# EAGLE design Milton (EAGLE 6.5.0)

## Sheet 1 of 2
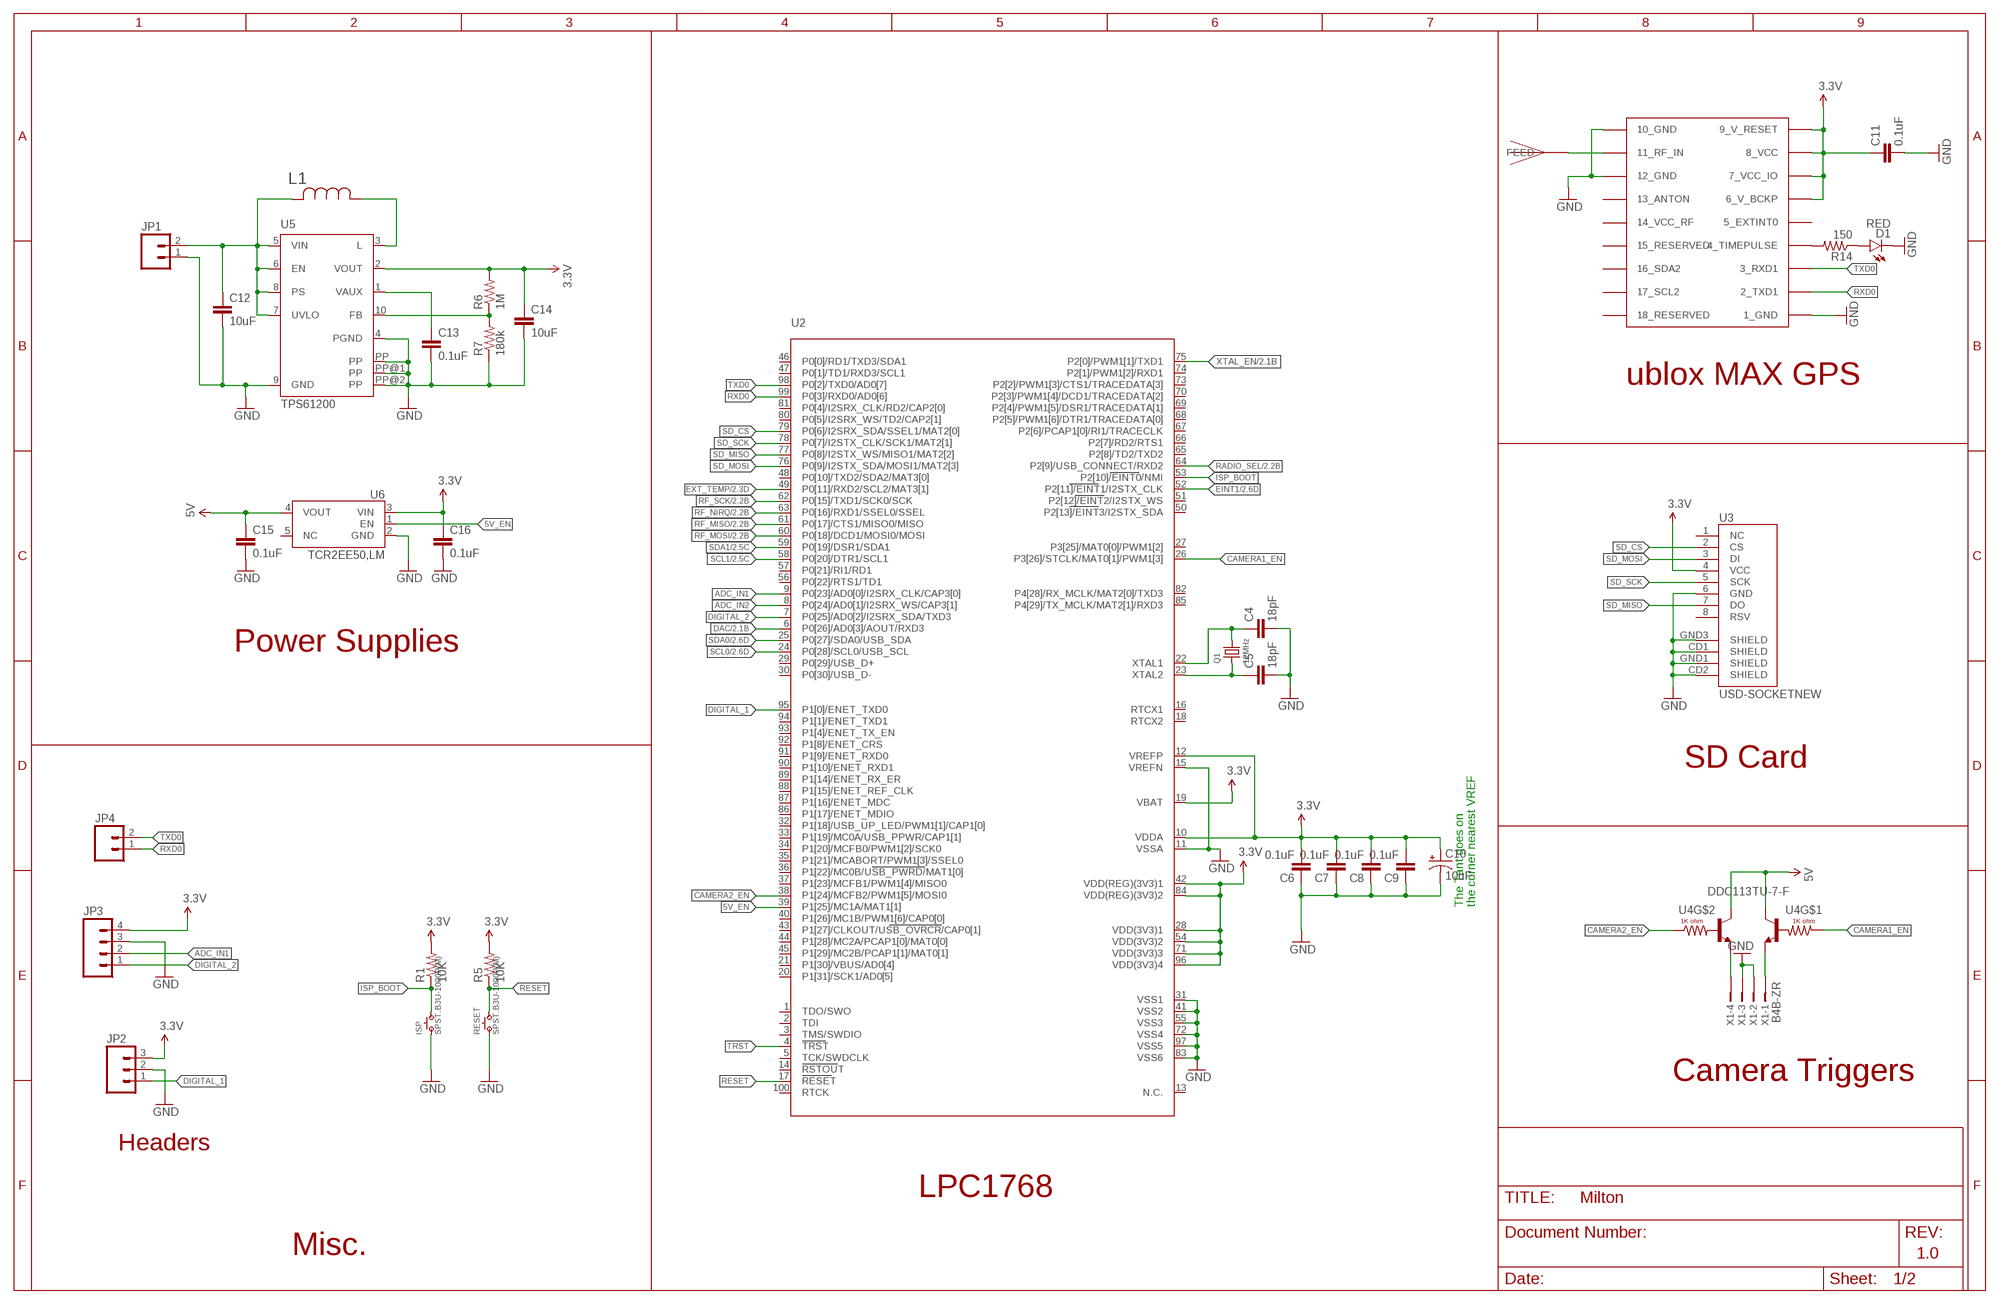
[diagram p0: schematic, sheet 1]

### Parts
C4  18pF  CAP0805  [0805]
C5  18pF  CAP0805  [0805]
C6  0.1uF  CAP0603-CAP  [0603-CAP]
C7  0.1uF  CAP0603-CAP  [0603-CAP]
C8  0.1uF  CAP0603-CAP  [0603-CAP]
C9  0.1uF  CAP0603-CAP  [0603-CAP]
C10  10uF  10UF-TANT  [EIA3216]
C11  0.1uF  CAP0603-CAP  [0603-CAP]
C12  10uF  CAP0805  [0805]
C13  0.1uF  CAP0603-CAP  [0603-CAP]
C14  10uF  CAP0805  [0805]
C15  0.1uF  CAP0603-CAP  [0603-CAP]
C16  0.1uF  CAP0603-CAP  [0603-CAP]
D1  RED  LED-RED0603  [LED-0603]
ISP  SPST.B3U-1000P(M)  [B3U-1000P(M)]
JP1  M02JST-PTH-2  [JST-2-PTH]
JP2  M03PTH  [1X03]
JP3  M04PTH  [1X04]
JP4  M02LOCK  [1X02_LOCK]
L1  SRN3015-2R2M  [IND_BOURNS_SRN3015]
Q1  12MHz  CRYSTALTHIN  [CRYSTAL_3.2X2.5]
R1  10K  RESISTOR0603  [0603-RES]
R5  10K  RESISTOR0603  [0603-RES]
R6  1M  RESISTOR0603  [0603-RES]
R7  180k  RESISTOR0603  [0603-RES]
R14  150  RESISTOR0603  [0603-RES]
RESET  SPST.B3U-1000P(M)  [B3U-1000P(M)]
U2  LPC1768  [LQFP100]
U3  USD-SOCKETNEW  [MICRO-SD-SOCKET-PP]
U4  DDC113TU-7-F  [SC70−6]
U5  TPS61200  [S-PDSO-N10]
U6  TCR2EE50,LM  IC_TCR2EEESV  [SOT50P160X60-5N]
U$2  1575AT43A40  JTI_ANTENNA-1575AT43A40  [JTI_ANTENNA-1575AT43A40]
U$3  UBLOX_MAX  [UBLOX_MAX]
X1  B4B-ZR  [B4B-ZR]

### Nets
3.3V [3.3v]: C6.2 C7.2 C8.2 C9.2 C10.A(+) C11.1 C14.1 C16.1 JP2.3 JP3.4 R1.2 R5.2 R6.2 U2.10(VDDA) U2.12(VREFP) U2.19(VBAT) U2.28(VDD(3V3)1) U2.42(VDD(REG)(3V3)1) U2.54(VDD(3V3)2) U2.71(VDD(3V3)3) U2.84(VDD(REG)(3V3)2) U2.96(VDD(3V3)4) U3.4(VCC) U5.2(VOUT) U6.3(VIN) U$3.6_V_BCKP U$3.7_VCC_IO U$3.8_VCC U$3.9_V_RESET ; also sheet 2
5V: C15.1 U4.3(C) U4.6(C) U6.4(VOUT)
5V_EN: U2.39(P1[25]/MC1A/MAT1[1]) U6.1(EN)
ADC_IN1: JP3.2 U2.9(P0[23]/AD0[0]/I2SRX_CLK/CAP3[0])
ADC_IN2: U2.8(P0[24]/AD0[1]/I2SRX_WS/CAP3[1])
CAM1: U4.1(E) X1.1
CAM2: U4.4(E) X1.4
CAMERA1_EN: U2.26(P3[26]/STCLK/MAT0[1]/PWM1[3]) U4.2(B)
CAMERA2_EN: U2.38(P1[24]/MCFB2/PWM1[5]/MOSI0) U4.5(B)
DAC: U2.6(P0[26]/AD0[3]/AOUT/RXD3) ; also sheet 2
DIGITAL_1: JP2.1 U2.95(P1[0]/ENET_TXD0)
DIGITAL_2: JP3.1 U2.7(P0[25]/AD0[2]/I2SRX_SDA/TXD3)
EINT1: U2.52(P2[11]/EINT1/I2STX_CLK) ; also sheet 2
EXT_TEMP: U2.49(P0[11]/RXD2/SCL2/MAT3[1]) ; also sheet 2
GND [gnd]: C4.2 C5.2 C6.1 C7.1 C8.1 C9.1 C10.C(-) C11.2 C12.2 C13.2 C14.2 C15.2 C16.2 D1.C ISP.1 JP1.1 JP2.2 JP3.3 R7.1 RESET.1 U2.11(VSSA) U2.15(VREFN) U2.31(VSS1) U2.41(VSS2) U2.55(VSS3) U2.72(VSS4) U2.83(VSS6) U2.97(VSS5) U3.6(GND) U3.CD1(SHIELD) U3.CD2(SHIELD) U3.GND1(SHIELD) U3.GND3(SHIELD) U5.4(PGND) U5.9(GND) U5.PP U5.PP@1(PP) U5.PP@2(PP) U6.2(GND) U$3.1_GND U$3.10_GND U$3.12_GND X1.2 X1.3 ; also sheet 2
IC6_RTC1: C4.1 Q1.2 U2.22(XTAL1)
IC6_RTC2: C5.1 Q1.1 U2.23(XTAL2)
ISP_BOOT: ISP.2 R1.1 U2.53(P2[10]/EINT0/NMI)
N$1: R6.1 R7.2 U5.10(FB)
N$8: U$2.FEED U$3.11_RF_IN
N$16: D1.A R14.1
N$19: L1.1 U5.3(L)
N$22: R14.2 U$3.4_TIMEPULSE
RADIO_SEL: U2.64(P2[9]/USB_CONNECT/RXD2) ; also sheet 2
RESET: R5.1 RESET.2 U2.17(RESET)
RF_MISO: U2.61(P0[17]/CTS1/MISO0/MISO) ; also sheet 2
RF_MOSI: U2.60(P0[18]/DCD1/MOSI0/MOSI) ; also sheet 2
RF_NIRQ: U2.63(P0[16]/RXD1/SSEL0/SSEL) ; also sheet 2
RF_SCK: U2.62(P0[15]/TXD1/SCK0/SCK) ; also sheet 2
RXD0: JP4.1 U2.99(P0[3]/RXD0/AD0[6]) U$3.2_TXD1
SCL0: U2.24(P0[28]/SCL0/USB_SCL) ; also sheet 2
SCL1: U2.58(P0[20]/DTR1/SCL1) ; also sheet 2
SD_CS: U2.79(P0[6]/I2SRX_SDA/SSEL1/MAT2[0]) U3.2(CS)
SD_MISO: U2.77(P0[8]/I2STX_WS/MISO1/MAT2[2]) U3.7(DO)
SD_MOSI: U2.76(P0[9]/I2STX_SDA/MOSI1/MAT2[3]) U3.3(DI)
SD_SCK: U2.78(P0[7]/I2STX_CLK/SCK1/MAT2[1]) U3.5(SCK)
SDA0: U2.25(P0[27]/SDA0/USB_SDA) ; also sheet 2
SDA1: U2.59(P0[19]/DSR1/SDA1) ; also sheet 2
TRST: U2.4(TRST)
TXD0: JP4.2 U2.98(P0[2]/TXD0/AD0[7]) U$3.3_RXD1
VAUX: C13.1 U5.1(VAUX)
VIN [VIN]: C12.1 JP1.2 L1.2 U5.5(VIN) U5.6(EN) U5.7(UVLO) U5.8(PS)
XTAL_EN: U2.75(P2[0]/PWM1[1]/TXD1) ; also sheet 2
Unconnected: U2.1(TDO/SWO) U2.2(TDI) U2.3(TMS/SWDIO) U2.5(TCK/SWDCLK) U2.13(N.C.) U2.14(RSTOUT) U2.16(RTCX1) U2.18(RTCX2) U2.20(P1[31]/SCK1/AD0[5]) U2.21(P1[30]/VBUS/AD0[4]) U2.27(P3[25]/MAT0[0]/PWM1[2]) U2.29(P0[29]/USB_D+) U2.30(P0[30]/USB_D-) U2.32(P1[18]/USB_UP_LED/PWM1[1]/CAP1[0]) U2.33(P1[19]/MC0A/USB_PPWR/CAP1[1]) U2.34(P1[20]/MCFB0/PWM1[2]/SCK0) U2.35(P1[21]/MCABORT/PWM1[3]/SSEL0) U2.36(P1[22]/MC0B/USB_PWRD/MAT1[0]) U2.37(P1[23]/MCFB1/PWM1[4]/MISO0) U2.40(P1[26]/MC1B/PWM1[6]/CAP0[0]) U2.43(P1[27]/CLKOUT/USB_OVRCR/CAP0[1]) U2.44(P1[28]/MC2A/PCAP1[0]/MAT0[0]) U2.45(P1[29]/MC2B/PCAP1[1]/MAT0[1]) U2.46(P0[0]/RD1/TXD3/SDA1) U2.47(P0[1]/TD1/RXD3/SCL1) U2.48(P0[10]/TXD2/SDA2/MAT3[0]) U2.50(P2[13]/EINT3/I2STX_SDA) U2.51(P2[12]/EINT2/I2STX_WS) U2.56(P0[22]/RTS1/TD1) U2.57(P0[21]/RI1/RD1) U2.65(P2[8]/TD2/TXD2) U2.66(P2[7]/RD2/RTS1) U2.67(P2[6]/PCAP1[0]/RI1/TRACECLK) U2.68(P2[5]/PWM1[6]/DTR1/TRACEDATA[0]) U2.69(P2[4]/PWM1[5]/DSR1/TRACEDATA[1]) U2.70(P2[3]/PWM1[4]/DCD1/TRACEDATA[2]) U2.73(P2[2]/PWM1[3]/CTS1/TRACEDATA[3]) U2.74(P2[1]/PWM1[2]/RXD1) U2.80(P0[5]/I2SRX_WS/TD2/CAP2[1]) U2.81(P0[4]/I2SRX_CLK/RD2/CAP2[0]) U2.82(P4[28]/RX_MCLK/MAT2[0]/TXD3) U2.85(P4[29]/TX_MCLK/MAT2[1]/RXD3) U2.86(P1[17]/ENET_MDIO) U2.87(P1[16]/ENET_MDC) U2.88(P1[15]/ENET_REF_CLK) U2.89(P1[14]/ENET_RX_ER) U2.90(P1[10]/ENET_RXD1) U2.91(P1[9]/ENET_RXD0) U2.92(P1[8]/ENET_CRS) U2.93(P1[4]/ENET_TX_EN) U2.94(P1[1]/ENET_TXD1) U2.100(RTCK) U3.1(NC) U3.8(RSV) U6.5(NC) U$3.5_EXTINT0 U$3.13_ANTON U$3.14_VCC_RF U$3.15_RESERVED U$3.16_SDA2 U$3.17_SCL2 U$3.18_RESERVED

### Notes on the sheet
- ublox MAX GPS
- Power Supplies
- SD Card
- The Tant goes on 
  the corner nearest VREF
- Camera Triggers
- Headers
- LPC1768
- Misc. | 1.0

## Sheet 2 of 2
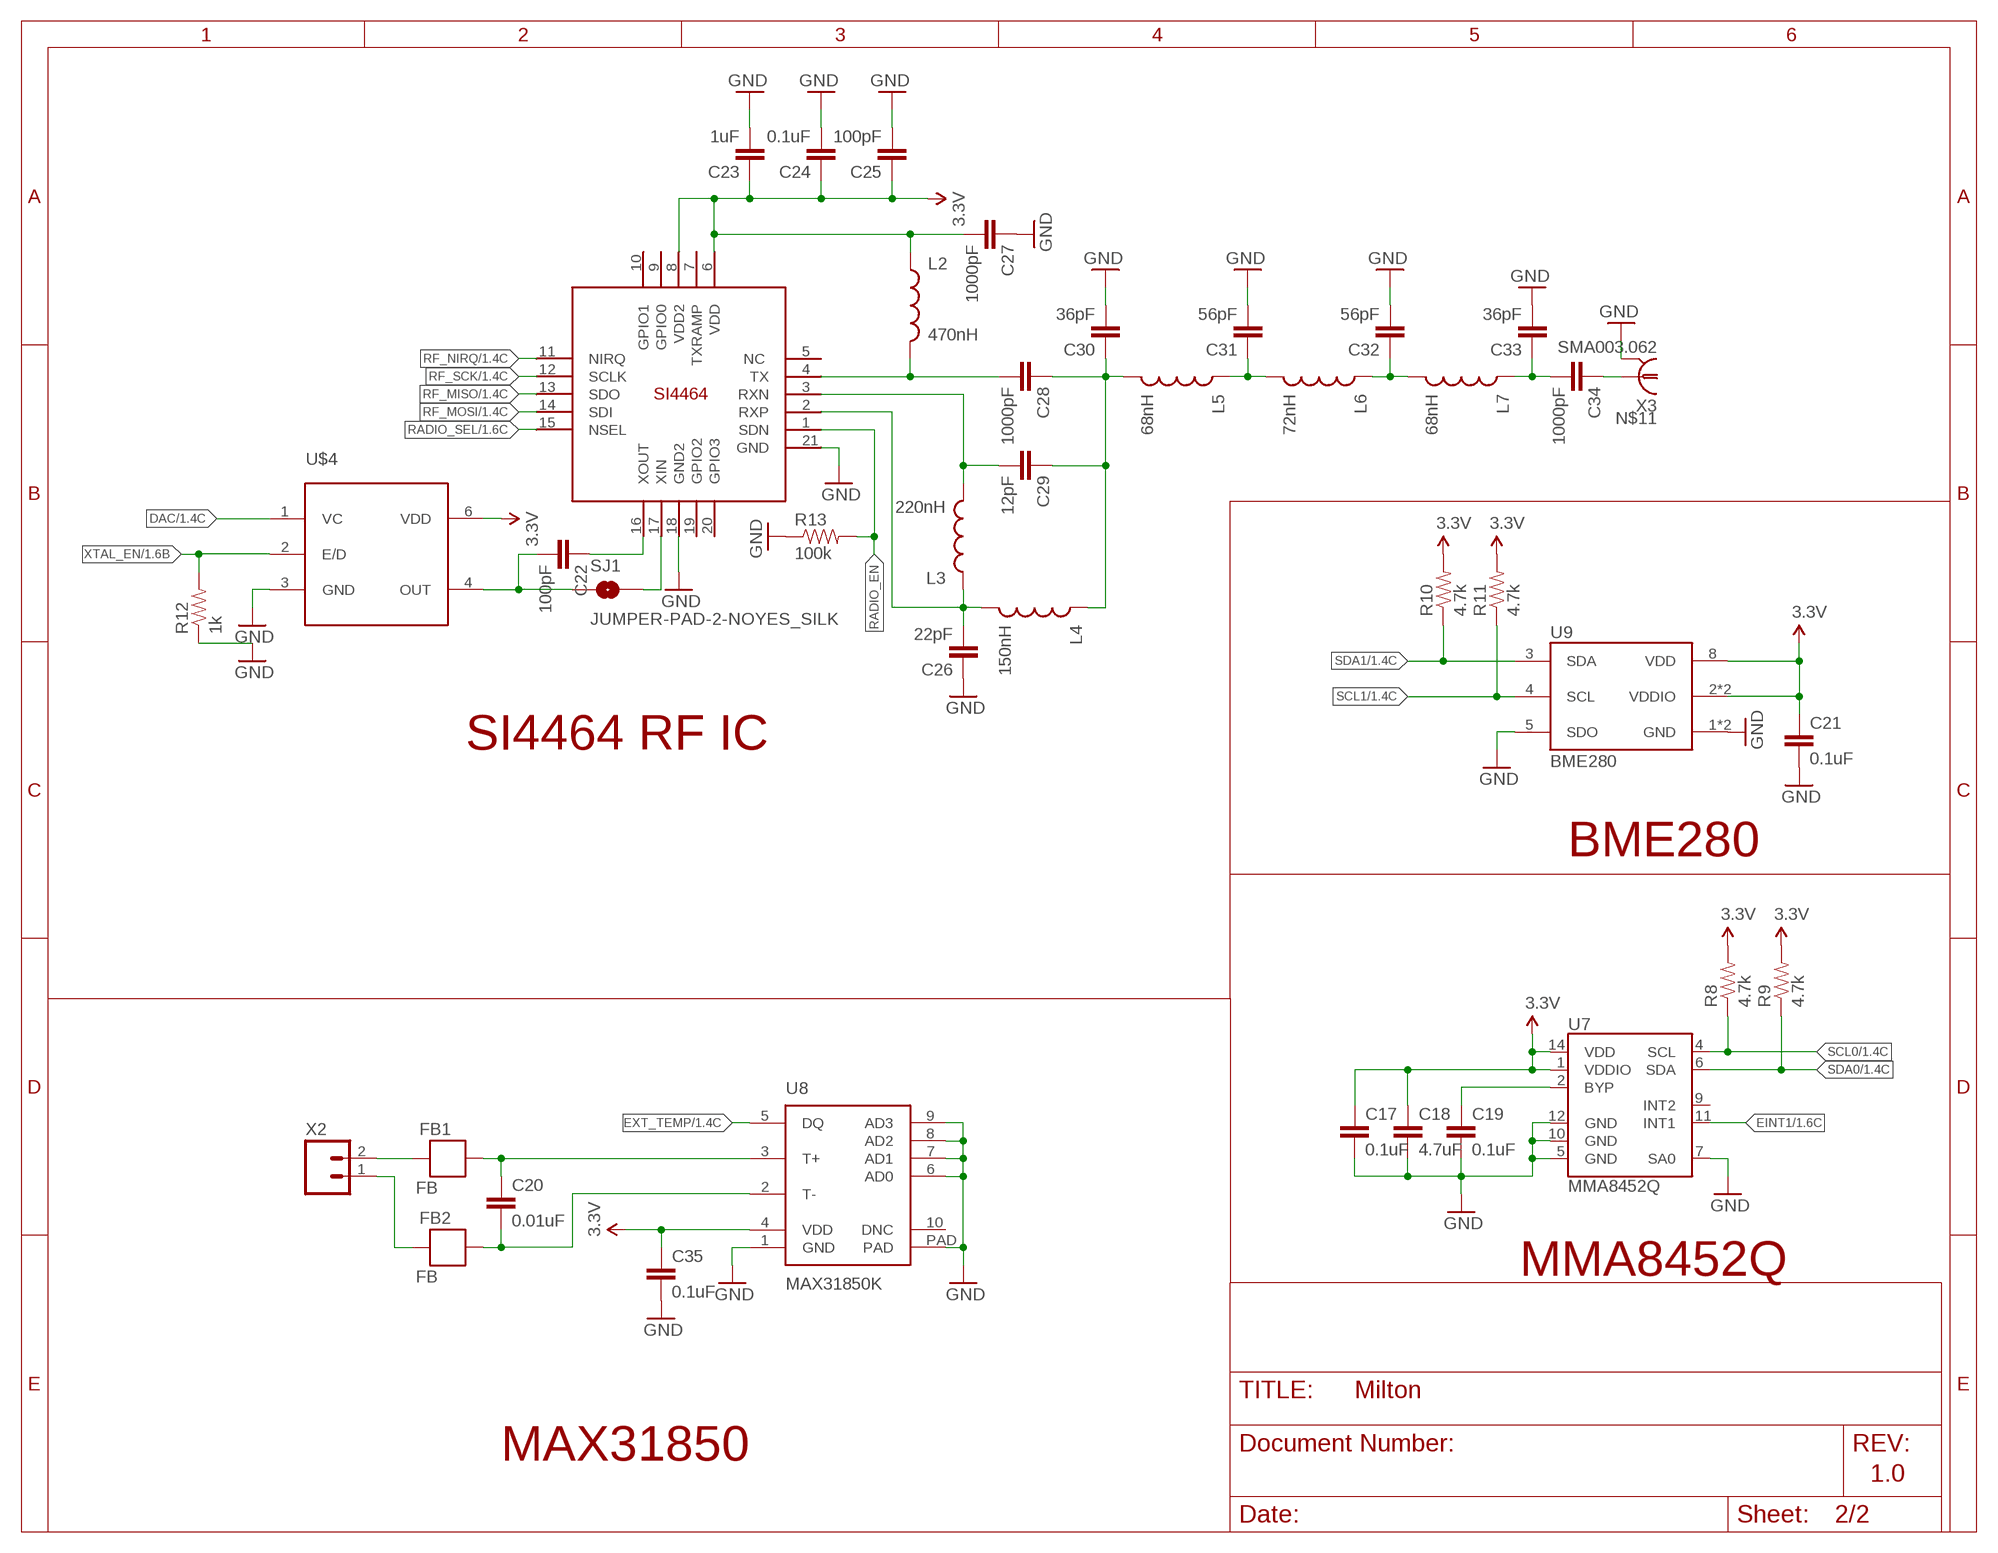
[diagram p1: schematic, sheet 2]

### Parts
C17  0.1uF  CAP0805  [0805]
C18  4.7uF  CAP0603-CAP  [0603-CAP]
C19  0.1uF  CAP0805  [0805]
C20  0.01uF  CAP0805  [0805]
C21  0.1uF  CAP0805  [0805]
C22  100pF  CAP0603-CAP  [0603-CAP]
C23  1uF  CAP0603-CAP  [0603-CAP]
C24  0.1uF  CAP0603-CAP  [0603-CAP]
C25  100pF  CAP0603-CAP  [0603-CAP]
C26  22pF  CAP0805  [0805]
C27  1000pF  CAP0603-CAP  [0603-CAP]
C28  1000pF  CAP0603-CAP  [0603-CAP]
C29  12pF  CAP0603-CAP  [0603-CAP]
C30  36pF  CAP0603-CAP  [0603-CAP]
C31  56pF  CAP0603-CAP  [0603-CAP]
C32  56pF  CAP0603-CAP  [0603-CAP]
C33  36pF  CAP0603-CAP  [0603-CAP]
C34  1000pF  CAP0805  [0805]
C35  0.1uF  CAP0805  [0805]
FB1  FB  [0603]
FB2  FB  [0603]
L2  470nH  INDUCTOR0603  [0603]
L3  220nH  INDUCTOR0603  [0603]
L4  150nH  INDUCTOR0603  [0603]
L5  68nH  INDUCTOR0603  [0603]
L6  72nH  INDUCTOR0603  [0603]
L7  68nH  INDUCTOR0603  [0603]
R8  4.7k  RESISTOR0603  [0603-RES]
R9  4.7k  RESISTOR0603  [0603-RES]
R10  4.7k  RESISTOR0603  [0603-RES]
R11  4.7k  RESISTOR0603  [0603-RES]
R12  1k  RESISTOR0603  [0603-RES]
R13  100k  RESISTOR0603  [0603-RES]
SJ1  JUMPER-PAD-2-NOYES_SILK  [PAD-JUMPER-2-NO_YES_SILK]
U7  MMA8452Q  [QFN-16_0.5MM]
U8  MAX31850K  [10-TDFN-EP]
U9  BME280  [BME280]
U10  SI4464  [QFN20+GNDPAD]
U$4  FVXO-HC53BR-27  [6-SMD]
X2  M023.5MM  [SCREWTERMINAL-3.5MM-2]
X3  SMA003.062  [SMA003.062]

### Nets
3.3V [3.3v]: C17.1 C18.1 C21.1 C23.1 C24.1 C25.1 C27.2 C35.1 L2.1 R8.2 R9.2 R10.2 R11.2 U7.1(VDDIO) U7.14(VDD) U8.4(VDD) U9.2(VDDIO) U9.6(VDDIO) U9.8(VDD) U10.6(VDD) U10.8(VDD2) U$4.6(VDD) ; also sheet 1
DAC: U$4.1(VC) ; also sheet 1
EINT1: U7.11(INT1) ; also sheet 1
EXT_TEMP: U8.5(DQ) ; also sheet 1
GND [gnd]: C17.2 C18.2 C19.2 C21.2 C23.2 C24.2 C25.2 C26.1 C27.1 C30.2 C31.2 C32.2 C33.2 C35.2 R12.1 R13.1 U7.5(GND) U7.7(SA0) U7.10(GND) U7.12(GND) U8.1(GND) U8.6(AD0) U8.7(AD1) U8.8(AD2) U8.9(AD3) U8.PAD U9.1(GND) U9.5(SDO) U9.7(GND) U10.18(GND2) U10.21(GND) U$4.3(GND) X3.C2 X3.C3 X3.C4 X3.C5 ; also sheet 1
N$2: C19.1 U7.2(BYP)
N$6: C22.1 U10.16(XOUT)
N$11: C32.1 L6.1 L7.2
N$18: C28.2 L2.2 U10.4(TX)
N$20: C29.2 L3.2 U10.3(RXN)
N$28: C22.2 SJ1.1 U$4.4(OUT)
N$29: C26.2 L3.1 L4.2 U10.2(RXP)
N$30: C33.1 C34.2 L7.1
N$33: C34.1 X3.RF
N$36: C28.1 C29.1 C30.1 L4.1 L5.2
N$37: C31.1 L5.1 L6.2
N$38: SJ1.2 U10.17(XIN)
RADIO_EN: R13.2 U10.1(SDN)
RADIO_SEL: U10.15(NSEL) ; also sheet 1
RF_MISO: U10.13(SDO) ; also sheet 1
RF_MOSI: U10.14(SDI) ; also sheet 1
RF_NIRQ: U10.11(NIRQ) ; also sheet 1
RF_SCK: U10.12(SCLK) ; also sheet 1
SCL0: R8.1 U7.4(SCL) ; also sheet 1
SCL1: R11.1 U9.4(SCL) ; also sheet 1
SDA0: R9.1 U7.6(SDA) ; also sheet 1
SDA1: R10.1 U9.3(SDA) ; also sheet 1
TM_FILT: C20.2 FB2.1 U8.2(T-)
TM_RAW: FB2.2 X2.1
TP_FILT: C20.1 FB1.1 U8.3(T+)
TP_RAW: FB1.2 X2.2
XTAL_EN: R12.2 U$4.2(E/D) ; also sheet 1
Unconnected: U7.9(INT2) U8.10(DNC) U10.5(NC ) U10.7(TXRAMP) U10.9(GPIO0) U10.10(GPIO1) U10.19(GPIO2) U10.20(GPIO3)

### Notes on the sheet
- SI4464 RF IC
- BME280
- MMA8452Q
- MAX31850
- 1.0

## Library data of the parts
C4 C5 = SparkFun-Capacitors:CAP: Capacitor Standard 0603 ceramic capacitor, and 0.1" leaded capacitor.; MPN: C0603C180K3GACTU
C6-C9 C13 C15-C17 C19 C21 C24 C35 = SparkFun-Capacitors:CAP: Capacitor Standard 0603 ceramic capacitor, and 0.1" leaded capacitor.; MPN: CL10B104KO8NNNC
C10 = SparkFun-Capacitors:10UF-TANT: 10uF Tantalum SMT CAP-00811- 16V 10% (EIA-3216); MPN: F931A106KAA; PROD_ID: CAP-00811
C11 = SparkFun:CAP: Capacitor Standard 0603 ceramic capacitor, and 0.1" leaded capacitor.; MPN: CL10B104KO8NNNC
C12 C14 = SparkFun-Capacitors:CAP: Capacitor Standard 0603 ceramic capacitor, and 0.1" leaded capacitor.; MPN: GRM21BR61C106KE15L
C18 = SparkFun-Capacitors:CAP: Capacitor Standard 0603 ceramic capacitor, and 0.1" leaded capacitor.; MPN: CC0603KRX5R6BB475
C20 = SparkFun-Capacitors:CAP: Capacitor Standard 0603 ceramic capacitor, and 0.1" leaded capacitor.; MPN: C0603C103J5RACTU
C22 C25 = SparkFun-Capacitors:CAP: Capacitor Standard 0603 ceramic capacitor, and 0.1" leaded capacitor.; MPN: CL10B101KB8NNNC
C23 = SparkFun-Capacitors:CAP: Capacitor Standard 0603 ceramic capacitor, and 0.1" leaded capacitor.; MPN: CL10B105KP8NNNC
C26 = SparkFun:CAP: Capacitor Standard 0603 ceramic capacitor, and 0.1" leaded capacitor.; MPN: C1608C0G1H220J080AA
C27 C28 = SparkFun-Capacitors:CAP: Capacitor Standard 0603 ceramic capacitor, and 0.1" leaded capacitor.; MPN: C0603C102J5RACTU
C29 = SparkFun-Capacitors:CAP: Capacitor Standard 0603 ceramic capacitor, and 0.1" leaded capacitor.; MPN: CL10C120JB8NNNC
C30 C33 = SparkFun-Capacitors:CAP: Capacitor Standard 0603 ceramic capacitor, and 0.1" leaded capacitor.; MPN: GRM1885C1H360JA01D
C31 C32 = SparkFun-Capacitors:CAP: Capacitor Standard 0603 ceramic capacitor, and 0.1" leaded capacitor.; MPN: CL10C560JB8NNNC
C34 = SparkFun:CAP: Capacitor Standard 0603 ceramic capacitor, and 0.1" leaded capacitor.; MPN: C0603C102J5RACTU
D1 = SparkFun-LED:LED-RED: Assorted Red LEDs LilyPad 1206- DIO-09912 1206- DIO-00809 0603- DIO-00819; MPN: LS L29K-G1J2-1-Z; PROD_ID: DIO-00819
FB1 FB2 = SparkFun-Passives:FB; MPN: BLM18PG471SN1D
ISP RESET = omron:SPST
JP1 = SparkFun-Connectors:M02: Standard 2-pin 0.1" header. Use with - straight break away headers ( PRT-00116) - right angle break away headers (PRT-00553) - swiss pins (PRT-00743) - machine pins (PRT-00117) - female headers (PRT-00115) Molex polarized connector foot print use with: PRT-08233 with associated crimp pins and housings. 2.54_SCREWTERM for use with PRT-10571. 3.5mm Screw Terminal footprints for PRT-08084 5mm Screw Terminal footprints for use with PRT-08432; MPN: S2B-PH-K-S(LF)(SN); PROD_ID: CONN-09863; SKU: PRT-09914
JP2 = SparkFun-Connectors:M03: Header 3 Standard 3-pin 0.1" header. Use with straight break away headers (SKU : PRT-00116), right angle break away headers (PRT-00553), swiss pins (PRT-00743), machine pins (PRT-00117), and female headers (PRT-00115). Molex polarized connector foot print use with SKU : PRT-08232 with associated crimp pins and housings.
JP3 = SparkFun-Connectors:M04: Header 4 Standard 4-pin 0.1" header. Use with straight break away headers (SKU : PRT-00116), right angle break away headers (PRT-00553), swiss pins (PRT-00743), machine pins (PRT-00117), and female headers (PRT-00115). Molex polarized connector foot print use with SKU : PRT-08231 with associated crimp pins and housings. 1MM SMD Version SKU: PRT-10208
JP4 = SparkFun-Connectors:M02: Standard 2-pin 0.1" header. Use with - straight break away headers ( PRT-00116) - right angle break away headers (PRT-00553) - swiss pins (PRT-00743) - machine pins (PRT-00117) - female headers (PRT-00115) Molex polarized connector foot print use with: PRT-08233 with associated crimp pins and housings. 2.54_SCREWTERM for use with PRT-10571. 3.5mm Screw Terminal footprints for PRT-08084 5mm Screw Terminal footprints for use with PRT-08432
L1 = wrea:SRN3015-2R2M; MANUFACTURER_PART_NUMBER: SRN3015-2R2M; MPN: SRN3015-4R7M; VENDOR: Bourns Electronics
L2 = SparkFun-Passives:INDUCTOR: Inductors Basic Inductor/Choke - 0603 and 1206. Footprints are not proven and vary greatly between part numbers. SRN6045- 33uH, 20% 1.4A SDR0403-560KL - 56uH, 10%, 500mA RMS/740mA peak; MPN: L0603CR47JRMST
L3 = SparkFun-Passives:INDUCTOR: Inductors Basic Inductor/Choke - 0603 and 1206. Footprints are not proven and vary greatly between part numbers. SRN6045- 33uH, 20% 1.4A SDR0403-560KL - 56uH, 10%, 500mA RMS/740mA peak; MPN: LQW18ANR22G00D
L4 = SparkFun-Passives:INDUCTOR: Inductors Basic Inductor/Choke - 0603 and 1206. Footprints are not proven and vary greatly between part numbers. SRN6045- 33uH, 20% 1.4A SDR0403-560KL - 56uH, 10%, 500mA RMS/740mA peak; MPN: LQW18ANR15G00D
L5 L7 = SparkFun-Passives:INDUCTOR: Inductors Basic Inductor/Choke - 0603 and 1206. Footprints are not proven and vary greatly between part numbers. SRN6045- 33uH, 20% 1.4A SDR0403-560KL - 56uH, 10%, 500mA RMS/740mA peak; MPN: LQW18AN68NG00D
L6 = SparkFun-Passives:INDUCTOR: Inductors Basic Inductor/Choke - 0603 and 1206. Footprints are not proven and vary greatly between part numbers. SRN6045- 33uH, 20% 1.4A SDR0403-560KL - 56uH, 10%, 500mA RMS/740mA peak; MPN: LQW18AN72NG00D
Q1 = microbuilder:CRYSTAL: Crystals HC49UP - Surface Mount Crystal 4.0MHz 18pF +/-30ppm Surface Mount Crystal [Digikey: 535-9857-1-ND] 12.0 MHz Surface Mount Crystal [Digikey: 535-9869-6-ND] 25.0 MHz Surface Mount Crystal [Digikey: 535-9078-1-ND] 3.2 x 2.5mm - MEMs SMT Crystal 12.0 MHz 8pF 15ppm 3.2 x 2.5mm Crystal [Digikey: -10-70°C: 644-1047-1-ND -40-125°C: 644-1128-1-ND] 16.0 MHz 8pF 15ppm 3.2 x 2.5mm Crystal [Digikey: -10-70°C: 644-1049-1-ND -40-125°C: 644-1129-2-ND] 16.0 MHz 10pF 10ppm 3.2 x 2.5mm Crystal [Digikey: 644-1100-1-ND] 27.12 MHz 18pF 30ppm 3.2 x 2.5mm Crystal [Digikey: 887-1424-1-ND] 27.12MHz 10pF 10ppm 3.2 x 2.5mm Crystal [Digikey: 887-1329-1-ND] 4.9 x 1.8mm - MEMs SMT Crystal 32.768 KHz 12.5pF 20ppm 4.9 x 1.8mm Crystal [Digikey: SE2415CT-ND] Cylinder 32.768KHz Cylinder Crystal; MPN: 7V-12.000MAHE-T
R1 R5 = SparkFun-Resistors:RESISTOR: Resistor Basic schematic elements and footprints for 0603, 1206, and PTH resistors.; MPN: ESR03EZPJ103
R6 = SparkFun-Resistors:RESISTOR: Resistor Basic schematic elements and footprints for 0603, 1206, and PTH resistors.; MPN: MCT06030C1004FP500
R7 = SparkFun-Resistors:RESISTOR: Resistor Basic schematic elements and footprints for 0603, 1206, and PTH resistors.; MPN: RC1608F184CS
R8-R11 = SparkFun-Resistors:RESISTOR: Resistor Basic schematic elements and footprints for 0603, 1206, and PTH resistors.; MPN: ERJ-3GEYJ472V
R12 = SparkFun-Resistors:RESISTOR: Resistor Basic schematic elements and footprints for 0603, 1206, and PTH resistors.; MPN: RMCF0603JT1K00
R13 = SparkFun-Resistors:RESISTOR: Resistor Basic schematic elements and footprints for 0603, 1206, and PTH resistors.; MPN: MCT06030C1003FP500
R14 = SparkFun-Resistors:RESISTOR: Resistor Basic schematic elements and footprints for 0603, 1206, and PTH resistors.; MPN: ESR03EZPJ151
SJ1 = SparkFun-Passives:JUMPER-PAD-2-NO
U2 = microbuilder:LPC1768: LPC1768 100 MHz 32-bit ARM Cortex-M3 based microcontroller featuring a high level of integration and low power consumption. 512 kB Flash, 64 kB SRAM, USB Device/Host/OTG, Ethernet, CAN, I2S, 10-bit DAC Digikey: 568-4796-ND; MPN: LPC1768FBD100,551
U3 = SparkFun:USD-SOCKET: microSD Socket Push-push type uSD socket. Schematic element and footprint production proven. Spark Fun Electronics SKU : PRT-00127. tDoc lines correctly indicate media card edge positions when inserting (unlocked, locked, depressed).; MPN: 101-00660-68-6
U4 = wrea:DDC113TU-7-F; MPN: DDC113TU-7-F
U5 = texas:TPS6120*: LOW INPUT VOLTAGE SYNCHRONOUS BOOST CONVERTER WITH 1.3-A SWITCHES Source: http://focus.ti.com/lit/ds/symlink/tps61200.pdf; MPN: TPS61200DRCR; OC_FARNELL: 1471238; OC_NEWARK: 37M0066
U6 = Xevelabs:IC_TCR2EE
U7 = SparkFun-Sensors:MMA8452Q: MMA8452Q 3-Axis, 12/8-bit Digital Accelerometer Supply Voltage: 1.6-3.6V Range: +/- 2g, 4g, 8g Interface: I2C, 12-bit and 8-bit ODR: 1.56 Hz - 800 Hz Package: QFN-16 http://cache.freescale.com/files/sensors/doc/data_sheet/MMA8452Q.pdf; MPN: MMA8452QT; PROD_ID: IC-10769
U8 = LoganSmith-Analog_IC:MAX3185?*: Cold-Junction Compensated, 1-Wire Thermocouple-to-Digital Converters Datasheet <http://datasheets.maximintegrated.com/en/ds/MAX31850-MAX31851.pdf>; DIGIKEY_OC: MAX31850KATB+-ND; MFR: Maxim Integrated; MPN: MAX31850TATB+; VALUE: Type K
U9 = wrea:BME280
U10 = ava:SI4464; MPN: SI4464-B1B-FM
U$2 = ava:JTI_ANTENNA-1575AT43A40; MPN: 1575AT43A0040E
U$3 = ava:UBLOX_MAX: UBLOX MAX; MPN: MAX-7C-0
U$4 = wrea:FVXO-HC53BR-27; MPN: FVXO-HC53BR-27
X1 = con-jst:?4B-ZR: ZH CONNECTOR 1.5 mm, 4 pin 1 row Source: http://www.jst.com .. eZH.pdf; MF: FARNELL; MPN: B4B-ZR(LF)(SN); OC_FARNELL: 1830916; OC_NEWARK: 37K9960
X2 = SparkFun-Connectors:M02: Standard 2-pin 0.1" header. Use with - straight break away headers ( PRT-00116) - right angle break away headers (PRT-00553) - swiss pins (PRT-00743) - machine pins (PRT-00117) - female headers (PRT-00115) Molex polarized connector foot print use with: PRT-08233 with associated crimp pins and housings. 2.54_SCREWTERM for use with PRT-10571. 3.5mm Screw Terminal footprints for PRT-08084 5mm Screw Terminal footprints for use with PRT-08432; MPN: ED555/2DS; PROD_ID: CONN-08399
X3 = wrea:SMA003.062

## Net classes
0 default: width 0.152 mm, drill 0.406 mm, clearance 0.152 mm
1 power: width 0.356 mm, drill 0.406 mm, clearance 0.152 mm
2 gnd: width 0.152 mm, drill 0.406 mm, clearance 0.203 mm
3 VIN: width 0.3 mm, drill 0.254 mm, clearance 0.152 mm
4 caps: width 3.54 mm, drill 0.406 mm, clearance 0.152 mm
5 3.3v: width 0.152 mm, drill 0.406 mm, clearance 0.152 mm

## Board
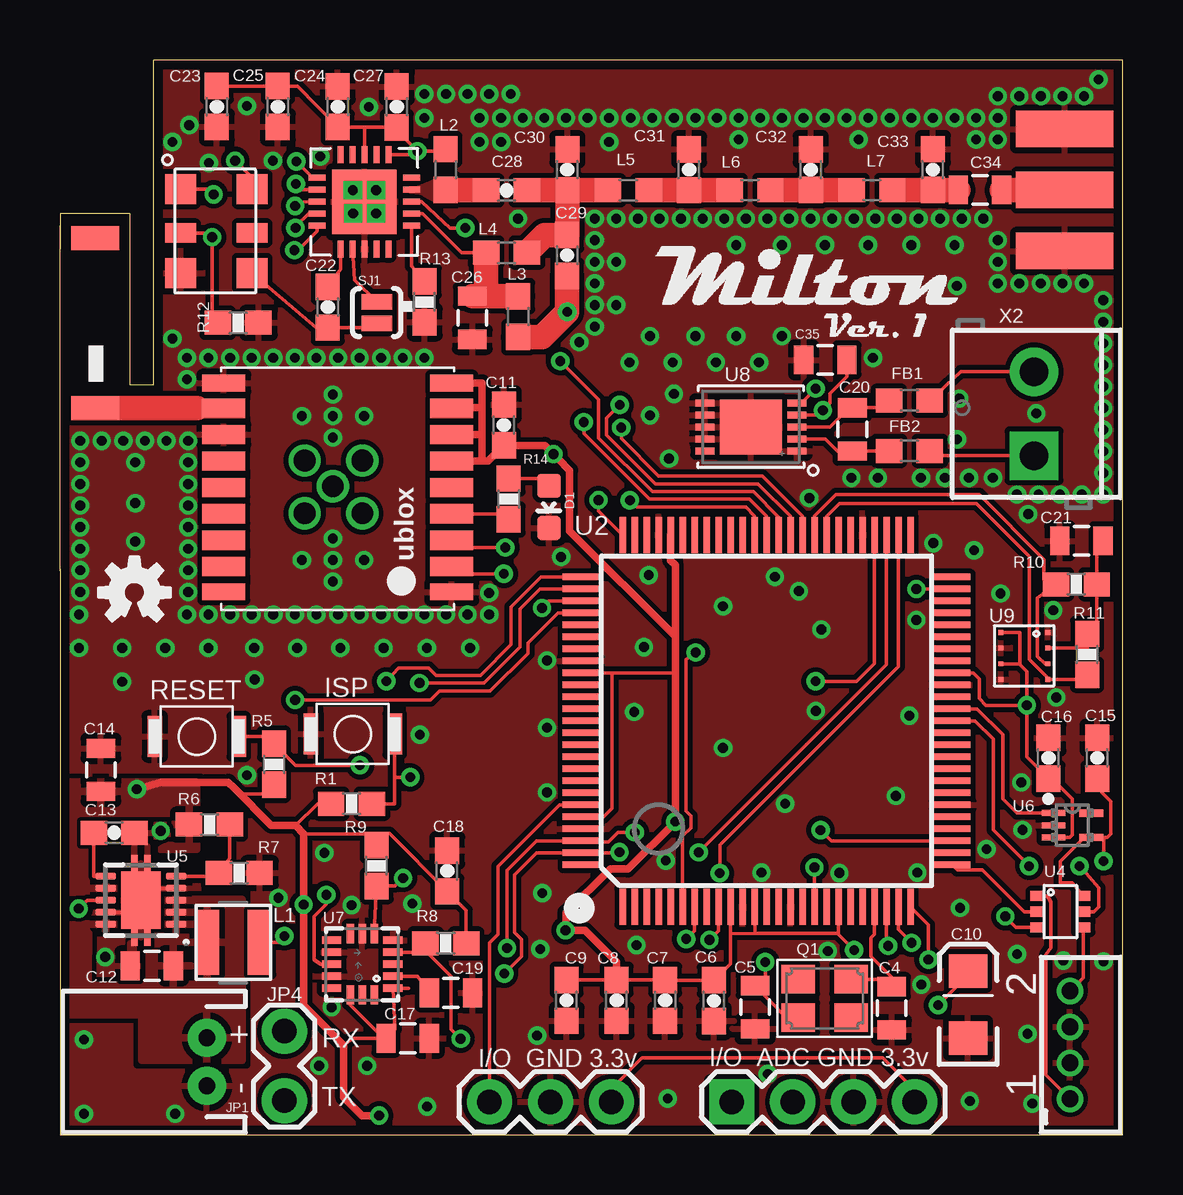
[diagram p2: board, top side]
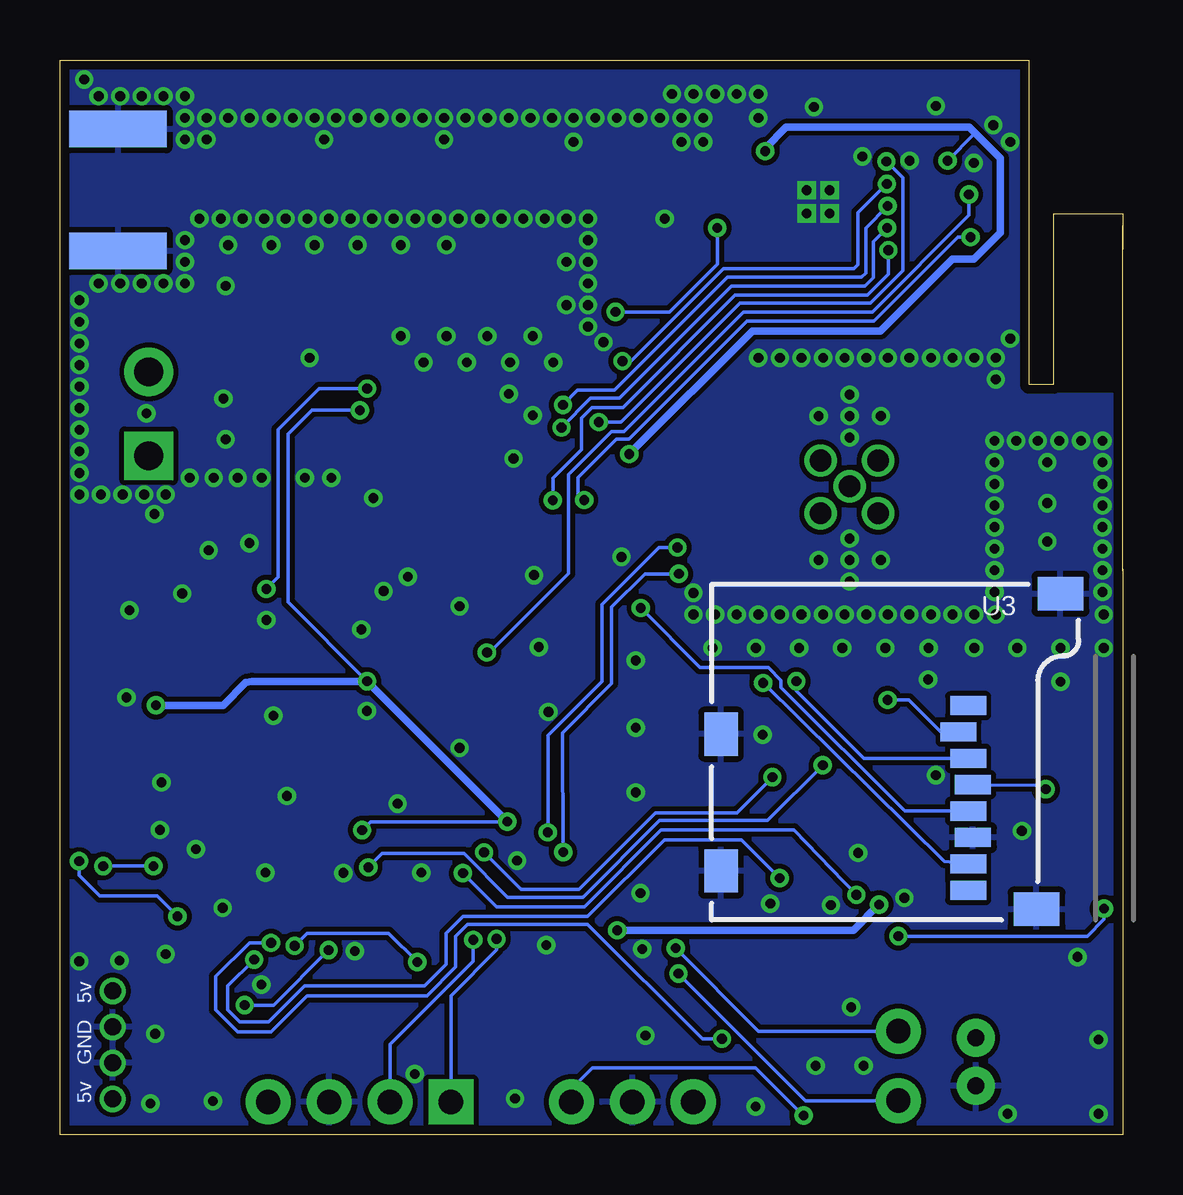
[diagram p3: board, bottom side, seen from below]

Size 44.3 x 44.8 mm. Coordinates in mm from the lower left corner, seen from the top.
Outline: 0,36.91 0,38.4 2.9,38.4 2.9,31.27 3.9,31.27 3.9,44.8 44.3,44.8 44.3,0 0,0 0,23.59
Outline: 0,23.5 0,37.9
Copper layers (1*16): Top 0.0356mm / dielectric 1.5011mm / Bottom 0.0356mm
Design rules "LaenPCBOrder": minimum track width 6mil, minimum drill 13mil, track to track 6mil, track to pad 6mil, pad to pad 6mil, via to via 6mil, smd to smd 6mil, copper to edge 15mil, drill to drill 6mil, minimum pad ring 7mil, minimum via ring 7mil, stop-mask expansion 3mil, vias tented up to drill 0mil, thermal gap 10mil

### Footprints (pad centres in the part's own frame; a part is rotated, then mirrored left to right if it is on the bottom)
0805 = smd 0.8 x 1.2: 1 -0.9,0; 2 0.9,0
0603-CAP = smd 1.1 x 1: 1 -0.85,0; 2 0.85,0
EIA3216 = smd 1.4 x 1.6: A 1.4,0; C -1.4,0
LED-0603 = smd 1 x 1: A 0,-0.877; C 0,0.877
0603 = smd 1.1 x 1: 1 -0.85,0; 2 0.85,0
B3U-1000P(M) = smd 0.6 x 1.7: 1 -1.75,0; 2 1.75,0
JST-2-PTH = drill 0.7 pad 1.6: 1 -1,0; 2 1,0
1X03 = drill 1.016 pad 1.88: 1 0,0; 2 2.54,0; 3 5.08,0
1X04 = drill 1.016 pad 1.88 square: 1 0,0 | drill 1.016 pad 1.88: 2 2.54,0; 3 5.08,0; 4 7.62,0
1X02_LOCK = drill 1.016 pad 1.88: 1 -0.178,0; 2 2.718,0
IND_BOURNS_SRN3015 = smd 0.991 x 2.692: 1 1.092,0; 2 -1.092,0
CRYSTAL_3.2X2.5 = smd 1.4 x 1.2: 1 -1.1,-0.8; 2 1.1,0.8; GND1 -1.1,0.8; GND2 1.1,-0.8
0603-RES = smd 1.1 x 1: 1 -0.85,0; 2 0.85,0
PAD-JUMPER-2-NO_YES_SILK = smd 0.635 x 1.27: 1 -0.45,0; 2 0.45,0
LQFP100 = smd 0.27 x 1.5: 1 -6,-7.75; 2 -5.5,-7.75; 3 -5,-7.75; 4 -4.5,-7.75; 5 -4,-7.75; 6 -3.5,-7.75; 7 -3,-7.75; 8 -2.5,-7.75; 9 -2,-7.75; 10 -1.5,-7.75; 11 -1,-7.75; 12 -0.5,-7.75; 13 0,-7.75; 14 0.5,-7.75; 15 1,-7.75; 16 1.5,-7.75; 17 2,-7.75; 18 2.5,-7.75; 19 3,-7.75; 20 3.5,-7.75; 21 4,-7.75; 22 4.5,-7.75; 23 5,-7.75; 24 5.5,-7.75; 25 6,-7.75; 51 6,7.75; 52 5.5,7.75; 53 5,7.75; 54 4.5,7.75; 55 4,7.75; 56 3.5,7.75; 57 3,7.75; 58 2.5,7.75; 59 2,7.75; 60 1.5,7.75; 61 1,7.75; 62 0.5,7.75; 63 0,7.75; 64 -0.5,7.75; 65 -1,7.75; 66 -1.5,7.75; 67 -2,7.75; 68 -2.5,7.75; 69 -3,7.75; 70 -3.5,7.75; 71 -4,7.75; 72 -4.5,7.75; 73 -5,7.75; 74 -5.5,7.75; 75 -6,7.75 | smd 1.5 x 0.27: 26 7.75,-6; 27 7.75,-5.5; 28 7.75,-5; 29 7.75,-4.5; 30 7.75,-4; 31 7.75,-3.5; 32 7.75,-3; 33 7.75,-2.5; 34 7.75,-2; 35 7.75,-1.5; 36 7.75,-1; 37 7.75,-0.5; 38 7.75,0; 39 7.75,0.5; 40 7.75,1; 41 7.75,1.5; 42 7.75,2; 43 7.75,2.5; 44 7.75,3; 45 7.75,3.5; 46 7.75,4; 47 7.75,4.5; 48 7.75,5; 49 7.75,5.5; 50 7.75,6; 76 -7.75,6; 77 -7.75,5.5; 78 -7.75,5; 79 -7.75,4.5; 80 -7.75,4; 81 -7.75,3.5; 82 -7.75,3; 83 -7.75,2.5; 84 -7.75,2; 85 -7.75,1.5; 86 -7.75,1; 87 -7.75,0.5; 88 -7.75,0; 89 -7.75,-0.5; 90 -7.75,-1; 91 -7.75,-1.5; 92 -7.75,-2; 93 -7.75,-2.5; 94 -7.75,-3; 95 -7.75,-3.5; 96 -7.75,-4; 97 -7.75,-4.5; 98 -7.75,-5; 99 -7.75,-5.5; 100 -7.75,-6
MICRO-SD-SOCKET-PP = smd 0.8 x 1.5: 1 -8.94,10.7; 2 -7.84,10.3; 3 -6.74,10.7; 4 -5.64,10.9; 5 -4.54,10.7; 6 -3.44,10.9; 7 -2.34,10.7; 8 -1.24,10.7 | smd 1.8 x 1.4: CD1 -2.05,0.4; CD2 -7.75,0.4 | smd 1.4 x 1.9: GND1 -13.6,14.55; GND3 -0.45,13.55
SC70−6 = smd 0.6 x 0.42: 1 -0.95,0.65; 2 -0.95,0; 3 -0.95,-0.65; 4 0.95,-0.65; 5 0.95,0; 6 0.95,0.65
S-PDSO-N10 = smd 0.28 x 0.85: 1 -1,-1.475; 2 -0.5,-1.475; 3 0,-1.475; 4 0.5,-1.475; 5 1,-1.475; 6 1,1.475; 7 0.5,1.475; 8 0,1.475; 9 -0.5,1.475; 10 -1,1.475 | smd 2.4 x 1.65: PP 0,0 | smd 3.8 x 0.28: PP@1 0,0.275; PP@2 0,-0.275
SOT50P160X60-5N = smd 0.991 x 0.254: 1 -0.787,0.508; 2 -0.787,0; 3 -0.787,-0.508 | smd 0.991 x 0.305: 4 0.787,-0.508; 5 0.787,0.508
QFN-16_0.5MM = smd 0.8 x 0.3: 1 -1.275,1; 2 -1.275,0.5; 3 -1.275,0; 4 -1.275,-0.5; 5 -1.275,-1; 9 1.275,-1; 10 1.275,-0.5; 11 1.275,0; 12 1.275,0.5; 13 1.275,1 | smd 0.3 x 0.8: 6 -0.5,-1.275; 7 0,-1.275; 8 0.5,-1.275; 14 0.5,1.275; 15 0,1.275; 16 -0.5,1.275
10-TDFN-EP = smd 0.79 x 0.3: 1 -1.92,1; 2 -1.92,0.5; 3 -1.92,0; 4 -1.92,-0.5; 5 -1.92,-1; 6 1.92,-1; 7 1.92,-0.5; 8 1.92,0; 9 1.92,0.5; 10 1.92,1 | smd 2.6 x 2.3: PAD 0,0
BME280 = smd 0.2 x 0.2: 1 -0.98,0.975; 2 -0.33,0.975; 3 0.33,0.975; 4 0.98,0.975; 5 0.98,-0.975; 6 0.33,-0.975; 7 -0.33,-0.975; 8 -0.98,-0.975
QFN20+GNDPAD = smd 0.7 x 0.25: 1 -1.97,1; 2 -1.97,0.5; 3 -1.97,0; 4 -1.97,-0.5; 5 -1.97,-1; 11 1.97,-1; 12 1.97,-0.5; 13 1.97,0; 14 1.97,0.5; 15 1.97,1 | smd 0.25 x 0.7: 6 -1,-1.97; 7 -0.5,-1.97; 8 0,-1.97; 9 0.5,-1.97; 10 1,-1.97; 16 1,1.97; 17 0.5,1.97; 18 0,1.97; 19 -0.5,1.97; 20 -1,1.97 | smd 2.7 x 2.7: 21 0,0
JTI_ANTENNA-1575AT43A40 = smd 1 x 2: FEED -3.175,0; NC 3.925,0
UBLOX_MAX = smd 1.8 x 0.7: 1_GND 4.95,-4.4; 9_V_RESET 4.95,4.3; 10_GND -4.55,4.3; 18_RESERVED -4.55,-4.4 | smd 1.8 x 0.8: 2_TXD1 4.95,-3.35; 3_RXD1 4.95,-2.25; 4_TIMEPULSE 4.95,-1.15; 5_EXTINT0 4.95,-0.05; 6_V_BCKP 4.95,1.05; 7_VCC_IO 4.95,2.15; 8_VCC 4.95,3.25; 11_RF_IN -4.55,3.25; 12_GND -4.55,2.15; 13_ANTON -4.55,1.05; 14_VCC_RF -4.55,-0.05; 15_RESERVED -4.55,-1.15; 16_SDA2 -4.55,-2.25; 17_SCL2 -4.55,-3.35
6-SMD = smd 1.24 x 1.29: 1 -1.745,-1.45; 3 1.745,-1.45; 4 1.745,1.535; 6 -1.745,1.535 | smd 0.8 x 1.29: 2 0.075,-1.45; 5 0.075,1.535
B4B-ZR = drill 0.7 pad 1.1: 1 -2.25,0; 2 -0.75,0; 3 0.75,0; 4 2.25,0
SCREWTERMINAL-3.5MM-2 = drill 1.2 pad 2.032 square: 1 0,0 | drill 1.2 pad 2.032: 2 3.5,0
SMA003.062 = smd 4.06 x 1.52: C2 -0.42,2.54; C3 -0.42,-2.54; RF -0.42,0 | smd 4.06 x 1.52 bottom: C4 -0.42,2.54; C5 -0.42,-2.54

### Placement (x,y rotation side)
C4  34.67,5.28 270 top
C5  28.98,5.32 270 top
C6  27.26,5.59 90 top
C7  25.23,5.6 90 top
C8  23.2,5.6 90 top
C9  21.11,5.6 90 top
C10  37.85,5.43 90 top
C11  18.5,29.58 90 top
C12  3.83,7.04 180 top
C13  2.26,12.59 0 top
C14  1.7,15.21 90 top
C15  43.24,15.7 90 top
C16  41.2,15.7 90 top
C17  14.49,4.02 0 top
C18  16.14,10.99 90 top
C19  16.3,5.91 0 top
C20  33.02,29.4 270 top
C21  42.58,24.76 180 top
C22  11.16,34.49 270 top
C23  6.54,42.86 270 top
C24  11.58,42.85 90 top
C25  9.08,42.86 270 top
C26  17.19,34.05 90 top
C27  14.04,42.84 270 top
C28  18.62,39.37 180 top
C29  21.14,36.66 270 top
C30  21.15,40.22 90 top
C31  26.22,40.22 90 top
C32  31.3,40.23 90 top
C33  36.39,40.23 90 top
C34  38.35,39.38 180 top
C35  31.9,32.3 180 top
D1  20.38,26.17 180 top
FB1  35.41,30.6 0 top
FB2  35.41,28.5 0 top
ISP  12.2,16.7 0 top
JP1  6.12,3.04 90 top
JP2  17.9,1.37 0 top
JP3  28,1.37 0 top
JP4  9.35,1.6 90 top
L1  7.22,8.02 0 top
L2  16.07,40.23 270 top
L3  19.1,34.1 270 top
L4  18.61,36.77 180 top
L5  23.69,39.37 180 top
L6  28.77,39.38 180 top
L7  33.85,39.38 180 top
Q1  31.88,5.68 0 top
R1  12.15,13.8 180 top
R5  8.92,15.44 270 top
R6  6.23,12.93 180 top
R7  7.47,10.91 180 top
R8  16.08,7.97 0 top
R9  13.2,11.21 90 top
R10  42.37,22.94 0 top
R11  42.82,20.02 90 top
R12  7.43,33.85 180 top
R13  15.2,34.72 90 top
R14  18.7,26.5 270 top
RESET  5.7,16.6 0 top
SJ1  13.2,34.27 90 top
U2  29.45,17.25 0 top
U3  17.14,8.95 270 bottom
U4  41.7,9.3 0 top
U5  3.38,9.78 270 top
U6  42.2,12.9 0 top
U7  12.6,7.11 180 top
U8  28.8,29.5 180 top
U9  40.2,19.96 270 top
U10  12.69,38.88 180 top
U$1  [OSHW-LOGO-S]  3.1,22.6 0 top
U$2  1.46,33.46 90 top
U$3  11.38,27.03 0 top
U$4  6.48,37.66 270 top
X1  42.1,3.75 90 top
X2  40.6,28.3 90 top
X3  42.3,39.38 0 top

### Tracks (layer width: path | path; a pad name or v marks a point on that pad's centre or on a via)
3.3V  (via drill 0.41)
  Top 0.152: 12.69,41.99 11.72,41.99 C24.1 9.91,43.71 C25.1 C23.1 | 12.69,41.99 C27.2 14.04,41.87 v14.9,41 | U10.6 14.76,40.85 v14.9,41 | L2.1 16.21,41 v14.9,41 | U8.4 31.6,30 v31.8,30.2 32.1,30.5 32.1,30.9 32.8,31.6 C35.1 | U2.12 28.96,9.24 28.96,8.39 | 28.96,8.39 27.95,8.38 | 28.96,8.39 32.42,8.39 | U2.19 32.45,8.39 32.42,8.39 | C21.1 43.22,24.66 R10.2 43.22,21.34 R11.2 42.82,20.29 U9.2 | U$4.6 7.89,40.01 v7.3,40.6 | v40.3,17.9 40.3,15.75 C16.1 41.35,14.85 42.2,14 42.2,12.5 42.1,12.4 41.52,12.4 U6.3 | U2.10 27.95,8.38 | U2.54 33.95,19.65 33.2,18.9 v31.5,18.9 | U2.42 38.07,19.25 38.33,18.99 38.33,18.18 38.6,17.9 v40.3,17.9 | U2.96 22.65,13.25 23,13.6 23,19.25 | U2.84 23,19.25 | U10.8 12.69,41.99 | U2.28 32.15,12.25 v31.7,12.7 | 23,19.25 25.65,19.25 | R5.2 8.73,14.2 7.5,14.2 7.25,14.45 | 32.42,8.39 v33.1,7.7 | 27.95,8.38 27.95,7.13 C6.2 25.14,6.44 C7.2 C8.2 C9.2 | JP3.4 35.62,1.88 34.3,3.2 24.26,3.2 22.98,1.92 JP2.3 | 14.52,6.11 U7.1 13.97,4.4 C17.1 | 13.3,12.55 10.15,12.55 | U9.8 40,20.94 40,19.63 | v40.3,17.9 40.3,19.3 40,19.6 40,19.63 | U9.6 40,19.63 | R8.2 16.93,9.35 C18.1 13.73,12.55 13.3,12.55 | R1.2 10.73,13.8 9.83,12.9 | R9.2 13.2,12.45 13.3,12.55 | C10.A 37.85,6.65 v36.6,5.4 | C17.1 12.22,4.02 11.83,3.73 | U7.14 12.1,5.41 13.49,4.02 C17.1
  Top 0.305: U$3.9_V_RESET 17.6,31.33 17.6,30.3 | 17.6,30.3 16.33,30.3 U$3.8_VCC | 17.6,29.18 17.6,30.3 | 18.61,28.54 C11.1 | U$3.6_V_BCKP 17.6,28.08 | 17.6,28.08 17.85,28.08 C11.1 | C11.1 20.21,28.73 v20.57,28.37 20.77,28.16 21.25,27.69 21.25,25.16 25.65,20.76 | U$3.7_VCC_IO 17.6,29.18 | 17.6,29.18 17.6,28.09 17.6,28.08 | v3.2,14.4 4.19,14.69 7.01,14.69 7.25,14.45 8.8,12.9 9.83,12.9 10.15,12.55 v10.15,9.6 10.15,5.4 11.83,3.73 11.83,3.72 11.83,1.56 12.59,0.8 v13.3,0.8 | 25.65,20.76 25.65,19.25 v25.65,13.05 23.68,11.07 22.95,11.07 21.09,9.25 v21.07,8.52 21.89,8.52 23.2,7.2 23.2,6.49 C8.2 | 25.65,20.76 25.65,23.74 25.45,23.94 U2.71
  Bottom 0.152: v31.8,30.2 33.8,30.2 34.8,29.2 34.8,22.2 v31.5,18.9 | U3.4 3.45,14.57 v3.2,14.4 | v33.1,7.7 35.4,5.4 v36.6,5.4 | JP2.3 22.98,1.92 22.1,2.8 15.3,2.8 v13.3,0.8 | v25.65,13.05 31.35,13.05 v31.7,12.7 | v7.3,40.6 6.2,41.7 6.1,41.7
  Bottom 0.305: v40.3,17.9 37.5,17.9 36.55,18.85 36.3,18.9 v31.5,18.9 v25.65,13.05 | v21.07,8.52 11.23,8.52 v10.15,9.6 | v20.57,28.37 15.44,33.5 10.1,33.5 7.1,36.5 6.2,36.5 5.1,37.6 5.1,40.7 6.1,41.7 6.4,41.99 C27.2 14.9,41.13 v14.9,41
  pour Top (isolate 0.152): 0.4,14.7 5.7,14.7 5.7,11.9 4.2,11.9 4.8,12.3 4.8,13.4 1.4,13.4 1.4,11.2 2.4,11.2 2.4,9.9 0.4,9.9
5V  (via drill 0.41)
  Top 0.152: C15.1 43,14.7 43.8,13.9 43.8,12.55 43.65,12.4 43.5,12.4 | 43.5,12.4 43.09,12.4 U6.4 42.7,12.39 41.7,11.4 41.7,10.5 42.2,10.5 U4.6 42.75,10.05 | U4.3 39.85,8.65 v39.4,9.1 | v43.5,11.4 43.5,12.4
  Bottom 0.152: v39.4,9.1 40.25,9.95 U4.6 43.5,10.8 v43.5,11.4
5V_EN
  Top 0.152: U6.1 39.89,13.41 39.3,14 39.3,16.68 38.23,17.75 37.3,17.75 U2.39
ADC_IN1  (via drill 0.41)
  Top 0.152: v27.07,8.12 27.45,8.5 U2.9
  Bottom 0.152: v27.07,8.12 27.07,7.23 30.54,3.76 JP3.2
CAM1
  Top 0.152: U4.1 41.15,9.95 41.3,9.7 41.3,7.8 41.1,7.5 41.1,2.5 X1.1
CAM2
  Top 0.152: U4.4 42.65,6.54 X1.4
CAMERA1_EN
  Top 0.152: U4.2 40.19,9.3 38.45,11.04 37.41,11.04 U2.26
CAMERA2_EN  (via drill 0.41)
  Top 0.152: v40.4,11.2 38.9,12.7 38.9,16.49 38.15,17.24 U2.38 | U4.5 43.1,9.3 43.3,9.5 43.3,10.3 v42.5,11.2
  Bottom 0.152: v42.5,11.2 v40.4,11.2
DAC  (via drill 0.41)
  Top 0.152: U$4.1 6.19,39.41 v6.41,39.2 | U2.6 25.95,12.45 26.3,12.8 26.3,13.3 26.1,13.5 26.1,19.8 v26.5,20.1
  Bottom 0.152: v6.41,39.2 6.41,38.33 10.44,34.3 15.81,34.3 20.8,29.31 21.31,29.31 23.1,27.52 23.1,23.4 26.4,20.1 v26.5,20.1
DIGITAL_1
  Top 0.152: U2.95 20.82,13.75 18.26,11.2 18.26,8.36 17.9,8 JP2.1
DIGITAL_2  (via drill 0.41)
  Top 0.152: v26.1,8.16 26.45,8.51 U2.7
  Bottom 0.152: v26.1,8.16 26.1,7.7 28,5.8 JP3.1
EINT1  (via drill 0.41)
  Top 0.152: U7.11 10.89,7.11 10.6,7.3 10.6,9.1 11.1,9.6 v11.1,10 | v27.5,10.9 27.5,12.07 34.94,19.52 U2.52
  Bottom 0.152: v27.5,10.9 26.1,9.5 22.44,9.5 19.24,12.7 13.7,12.7 v11.1,10
EXT_TEMP  (via drill 0.41)
  Top 0.152: v35.7,22.75 35.75,22.75 U2.49 | 30.72,30.52 U8.5 30.9,30.5 v31.5,31.1
  Bottom 0.152: v31.5,31.1 33.5,31.1 35.2,29.4 35.2,23.25 v35.7,22.75
GND  (via drill 0.41, 0.41 pad 0.25)
  Top 0.152: U5.4 2.98,9.28 U5.PP | U5.9 4.15,10.28 U5.PP@1
  other vias: 0.84,28.93 43.49,28.49 23.19,38.19 24.09,38.19 24.99,38.19 25.89,38.19 26.79,38.19 27.69,38.19 28.59,38.19 29.49,38.19 30.39,38.19 31.29,38.19 32.19,38.19 33.09,38.19 33.99,38.19 34.89,38.19 35.79,38.19 36.69,38.19 37.59,38.19 38.49,38.19 39.09,37.29 23.19,36.39 13.39,32.39 12.49,32.39 11.59,32.39 10.69,32.39 9.79,32.39 8.89,32.39 7.99,32.39 7.09,32.39 6.19,32.39 13.18,39.38 12.21,39.38 13.18,38.41 12.21,38.41 41.41,21.86 39.09,42.39 38.19,42.39 37.29,42.39 36.39,42.39 35.49,42.39 34.59,42.39 33.69,42.39 32.79,42.39 31.89,42.39 30.99,42.39 30.09,42.39 29.19,42.39 28.29,42.39 27.39,42.39 26.49,42.39 25.59,42.39 24.69,42.39 23.79,42.39 22.89,42.39 21.99,42.39 21.09,42.39 20.19,42.39 19.29,42.39 39.09,43.29 22.29,35.49 39.99,43.29 40.89,43.29 41.79,43.29 42.69,43.29 43.29,43.99 14.29,21.69 13.39,21.69 12.49,21.69 11.59,21.69 10.69,21.69 9.79,21.69 8.89,21.69 7.99,21.69 0.79,21.69 37.52,9.46 43.49,7.23 5.39,42.09 22.29,38.19 22.29,37.29 22.29,36.39 22.29,34.59 19.09,38.19 10.85,40.78 15.19,21.69 16.09,21.69 16.99,21.69 17.89,21.69 17.89,22.59 32.49,10.91 1.74,28.93 2.64,28.93 3.54,28.93 4.44,28.93 5.34,28.93 0.84,28.03 0.84,27.13 0.84,26.23 0.84,25.33 0.84,24.43 0.84,23.53 0.84,22.63 5.29,21.69 5.29,32.39 5.34,28.03 5.34,27.13 5.34,26.23 5.34,25.33 5.34,24.43 5.34,23.53 5.34,22.63 36.41,24.66 39.21,22.56 6.19,21.69 7.09,21.69 20.3,19.77 4.2,12.67 39.9,7.53 14.69,9.63 34.84,14.13 31.74,21.06 30.23,13.8 40.13,12.71 41.53,18.23 18.39,42.39 17.49,42.39 16.99,43.39 16.09,43.39 15.19,43.39 17.89,43.39 18.79,43.39 41.82,7.26 40.08,14.68 38.63,11.9 6.21,40.51 7.79,42.89 8.88,40.6 43.49,34.79 43.49,33.89 43.49,32.99 43.49,32.09 43.49,31.19 43.49,30.29 43.49,29.39 43.49,27.59 43.49,26.69 1.88,7.41 9.11,9.87 12.87,42.85 24.03,7.91 20.3,16.97 20.3,14.27 24.59,29.99 37.29,37.09 35.49,37.09 33.69,37.09 31.89,37.09 30.09,37.09 28.19,37.09 37.39,35.39 30.09,33.29 28.19,33.29 26.49,33.29 24.59,33.29 3.14,28.03 3.14,26.33 3.14,24.73 25.59,30.89 42.59,26.69 41.69,26.69 40.79,26.69 38.89,27.39 37.89,27.39 33.89,32.39 37.49,30.69 37.39,28.99 35.7,21.45 32.99,27.39 34.09,27.39 36.89,27.39 35.89,27.39 25.54,32.2 27.34,32.2 29.14,32.2 8.11,18.98 35.41,17.47 0.79,20.29 2.59,20.29 4.39,20.29 6.19,20.29 8.09,20.29 9.89,20.29 11.69,20.29 13.49,20.29 15.29,20.29 24.34,20.33 27.64,22.03 27.64,16.13 35.74,10.93 11.38,24.86 11.38,29.06 11.38,29.96 11.38,23.96 11.38,23.06 11.38,30.86 10.08,23.96 12.68,23.96 12.68,29.96 10.08,29.96 38.11,24.36 30.81,22.66 31.51,17.66 29.8,23.25 23.94,17.63 20.89,24.09 7.79,14.99 29.24,10.93 14.29,32.39 15.19,32.39 10.8,2.87 12.16,9.57 11.03,11.74 25.25,11.43 19.89,4.13 20.11,10.07 29.51,2.53 24.54,23.33 15.01,16.67 1,3.97 4.8,0.87 1,0.87 25.33,1.5 37.93,1.41 40.53,1.3 40.33,4.21 5.29,31.49 4.69,33.19 20.02,7.74 32.01,7.65 35.91,6.25 17.09,20.29 2.59,18.89 15.3,1.17 11.32,5.32 12.8,2.87 4.69,41.39 31.23,26.54 25.39,28.19 23.74,32.2 39.09,36.39 39.09,35.49 39.99,35.49 40.89,35.49 41.79,35.49 42.69,35.49 39.89,26.69 40.7,30.07 40.36,25.87 22.29,33.69 21.64,33.04 23.19,34.59 18.39,41.39 17.49,41.39 22.89,41.39 28.29,41.49 33.29,41.49 39.09,41.49 38.19,41.49 15.19,42.39
  pour Top (rank 2): -0.6,-0.2 44.95,-0.2 45.05,44.85 3,45.25 3,30.9 -0.1,30.9
  pour Bottom (rank 2): 0.1,-0.1 45.25,0 44.85,45.45 3.8,45.2 3.9,30.8 0,30.8
IC6_RTC1
  Top 0.152: Q1.2 34.76,6.48 | 34.76,6.48 C4.1 | 34.76,6.48 33.8,7.44 33.8,8.2 33.95,8.35 U2.22
IC6_RTC2  (via drill 0.41)
  Top 0.152: v29.4,7.2 29.4,6.5 C5.1 30.26,4.88 Q1.1 | v34.52,7.87 34.45,7.94 U2.23
  Bottom 0.152: v29.4,7.2 30.6,8.4 33.99,8.4 v34.52,7.87
ISP_BOOT  (via drill 0.41)
  Top 0.152: U2.53 34.45,24.6 34.45,19.6 v26.62,11.77 | ISP.2 13.95,14.9 | 13.95,14.9 13.95,13.8 R1.1 | v14.6,14.9 13.95,14.9
  Bottom 0.152: v26.62,11.77 25.08,10.23 22.67,10.23 19.48,13.42 16.08,13.42 v14.6,14.9
N$1
  Top 0.152: U5.10 6.11,10.78 R7.2 7.08,11.51 R6.1
N$2
  Top 0.152: C19.1 14.9,6.61 U7.2
N$3  (via drill 0.9)
  other vias: 11.38,27.03
N$6
  Top 0.152: U10.16 11.69,36.07 C22.1
N$8
  Top 0.406: 5.73,30.3 U$3.11_RF_IN
  Top 1.025: U$2.FEED 5.73,30.3
N$11
  Top 1.025: L6.1 C32.1 L7.2
N$13  (via drill 0.9)
  other vias: 10.2,28.1
N$14  (via drill 0.9)
  other vias: 12.6,25.9
N$15  (via drill 0.9)
  other vias: 12.6,28.1
N$16
  Top 0.152: R14.1 20.28,27.35 D1.A
N$17  (via drill 0.9)
  other vias: 10.2,25.9
N$18
  Top 1.025: L2.2 17.77,39.38 C28.2
  pour Top (no thermals): 14.6,39.5 14.89,39.47 15.68,39.8 16.19,39.88 16.18,38.9 15.56,38.96 15,39.25 14.6,39.3
N$19  (via drill 0.41)
  Top 0.152: U5.3 1.13,9.78 v0.78,9.42 | L1.1 9.16,8.01 v9.36,8.28
  Bottom 0.152: v9.36,8.28 1.49,8.28 0.78,8.98 v0.78,9.42
N$20  (via drill 0.41)
  Top 0.152: v16.9,37.8 16.25,37.8 15.07,38.88 U10.3
  Top 1.025: C29.2 v21.14,34.3 20.1,33.25 L3.2
  Bottom 0.152: v21.14,34.3 18.9,34.3 16.9,36.3 v16.9,37.8
N$22
  Top 0.152: U$3.4_TIMEPULSE 18.57,25.88 R14.2
N$28
  Top 0.152: SJ1.1 13.19,33.64 C22.2 10.69,33.64 U$4.4
N$29
  Top 0.152: U10.2 15.11,38.38 16.74,36.77 L4.2 17.79,36.78
  Top 1.025: C26.2 17.77,34.95 | 17.77,34.95 L4.2 | L3.1 17.77,34.95
N$30
  Top 1.025: L7.1 C33.1 C34.2
N$33
  Top 1.025: C34.1 41.9,39.38 X3.RF
N$36
  Top 1.025: C28.1 C30.1 | L5.2 C30.1 | C30.1 21.15,37.51 C29.1 20.2,37.51 L4.1
N$37
  Top 1.025: L5.1 C31.1 L6.2
N$38
  Top 0.152: U10.17 12.29,35.63 SJ1.2
RADIO_EN
  Top 0.152: R13.2 14.66,36.2 U10.1
RADIO_SEL  (via drill 0.41)
  Top 0.152: 10.69,37.88 U10.15 10.72,37.66 9.93,36.88 v9.77,36.88 | U2.64 28.95,25.8 28.59,26.16 24.04,26.16 v23.76,26.44
  Bottom 0.152: v9.77,36.88 9.77,35.87 10.63,35 16.16,35 20.84,30.32 22.12,30.32 22.57,29.87 22.57,28.55 23.76,27.36 v23.76,26.44
RESET  (via drill 0.41)
  Top 0.152: v31.45,11.14 U2.17 | v12.5,15.4 9.81,15.4 R5.1 8.71,16.6 RESET.2
  Bottom 0.152: v31.45,11.14 30.87,11.72 27.46,11.72 25.64,9.9 22.5,9.9 19.3,13.1 14.8,13.1 v12.5,15.4
RF_MISO  (via drill 0.41)
  Top 0.152: U2.61 30.44,25.79 29.1,27.13 24.82,27.13 22.78,29.16 22.77,29.86 v23.33,30.42 | v9.8,38.72 9.99,38.88 U10.13
  Bottom 0.152: v9.8,38.72 9.8,38.7 10.71,37.78 10.71,35.92 10.9,35.74 16.48,35.74 21.18,31.03 22.72,31.03 v23.33,30.42
RF_MOSI  (via drill 0.41)
  Top 0.152: 10.94,38.38 U10.14 10.36,38.38 9.81,37.87 v9.82,37.8 | U2.60 30.95,25.8 29.29,27.46 24.95,27.46 23.4,29.01 v23.4,29.48
  Bottom 0.152: v9.82,37.8 10.39,37.23 10.39,35.73 10.75,35.37 16.31,35.37 20.98,30.7 22.18,30.7 v23.4,29.48
RF_NIRQ  (via drill 0.41)
  Top 0.152: U2.63 29.45,25.79 28.75,26.49 24.57,26.49 21.85,29.22 v21.84,29.7 | U10.11 10.54,39.88 v9.85,40.58
  Bottom 0.152: v9.85,40.58 9.16,39.89 9.16,36.02 10.51,34.67 15.96,34.67 20.92,29.7 v21.84,29.7
RF_SCK  (via drill 0.41)
  Top 0.152: U2.62 29.95,25.75 28.9,26.8 24.7,26.8 22.46,29.04 22.46,30.64 v20.85,32.24 | U10.12 10.08,39.38 v9.83,39.63
  Bottom 0.152: v20.85,32.24 20.48,32.26 16.64,36.1 11.21,36.1 11.04,36.28 11.04,38.44 v9.84,39.63 v9.83,39.63
RXD0  (via drill 0.41)
  Top 0.152: U$3.2_TXD1 16.39,23.38 v18.5,23.38 | v23.32,11.78 23.26,11.75 U2.99 19.87,11.75 18.95,10.84 18.95,8.44 19.25,8.14 19.25,7.45 v18.52,6.71
  Bottom 0.152: v18.5,23.38 19.92,23.38 21.3,22 21.3,18.8 23.35,16.75 v23.32,11.78 | JP4.1 13.22,1.42 v18.52,6.71
SCL0  (via drill 0.41)
  Top 0.152: U7.4 15.27,7.61 R8.1 15.43,7.47 16.3,6.6 16.3,4.4 v16.7,4 | 35,9.5 U2.24 34.95,8.55 v35.5,8
  Bottom 0.152: v35.5,8 36.4,8 37.8,6.6 37.8,5.2 36.9,4.3 35.5,4.3 34,5.8 29,5.8 27.8,7 27.8,8.28 27.3,8.78 22.3,8.78 17.53,4 v16.7,4
SCL1
  Top 0.152: U2.58 31.95,24.7 31.95,25.77 32.48,26.3 38.2,26.3 40.4,24.1 40.4,19.8 41.15,19.05 U9.4 42.92,18.98 R11.1
SD_CS  (via drill 0.41)
  Top 0.152: v9.8,18.12 15.45,18.12 15.83,18.5 17.93,18.5 19.5,20.07 19.5,20.5 20.75,21.75 U2.79
  Bottom 0.152: v9.8,18.12 8.92,18.12 7.59,16.79 U3.2
SD_MISO  (via drill 0.41)
  Top 0.152: v14.98,18.83 17.68,18.83 19.18,20.33 19.18,21.92 20.01,22.75 U2.77
  Bottom 0.152: U3.7 7.44,11.39 v14.98,18.83
SD_MOSI  (via drill 0.41)
  Top 0.152: v13.6,18.9 14.11,19.45 15.37,19.45 15.67,19.15 17.53,19.15 18.8,20.43 18.8,22 20.05,23.25 U2.76
  Bottom 0.152: U3.3 10.79,15.69 13.6,18.5 v13.6,18.9
SD_SCK  (via drill 0.41)
  Top 0.152: U2.78 20.39,22.25 v20.09,21.95
  Bottom 0.152: U3.5 9.09,13.49 14.24,18.64 14.24,18.94 14.76,19.48 17.61,19.48 v20.09,21.95
SDA0  (via drill 0.41)
  Top 0.152: v36.2,7.3 36.2,8.75 U2.25 | U7.6 R9.1 13.97,10.37 v14.3,10.7
  Bottom 0.152: v36.2,7.3 37.3,6.2 37.3,5.2 36.8,4.7 35.6,4.7 34.1,6.2 29.1,6.2 28.2,7.1 28.2,8.4 27.5,9.1 22.3,9.1 19.1,12.3 15.9,12.3 v14.3,10.7
SDA1
  Top 0.152: U2.59 31.45,25.79 32.34,26.68 38.32,26.68 41.02,23.98 41.02,23.14 R10.1 40.74,22.37 40.74,19.95 41.07,19.63 U9.3
TM_FILT
  Top 0.152: U8.2 31.9,29 32.4,28.5 C20.2 FB2.1
TM_RAW
  Top 0.152: FB2.2 36.35,28.3 X2.1
TP_FILT
  Top 0.152: U8.3 32.1,29.5 32.9,30.3 C20.1 34.26,30.3 FB1.1
TP_RAW
  Top 0.152: FB1.2 37.55,31.8 X2.2
TXD0  (via drill 0.41)
  Top 0.152: U$3.3_RXD1 16.42,24.48 v18.56,24.48 | U2.98 21.95,12.2 22.86,12.2 23.26,12.6 v23.96,12.6 | U2.98 | v18.63,7.78 18.63,11.01 19.87,12.25 U2.98
  Bottom 0.152: v18.56,24.48 19.32,24.48 21.7,22.1 21.7,18.9 23.96,16.64 v23.96,12.6 | JP4.2 15.18,4.32 v18.63,7.78
VAUX
  Top 0.152: C13.1 1.41,10.77 U5.1
VIN
  pour Top: 0.09,5 3.4,5 3.4,3.1 7.6,3.1 7.6,9.8 4,9.8 3.99,9.21 3.71,9.21 3.71,6.22 1.18,6.22 1.2,8.6 2.3,8.6 2.3,9.16 0.09,9.16
XTAL_EN  (via drill 0.41)
  Top 0.152: R12.2 6.34,34.21 v6.34,37.41 6.17,37.59 U$4.2 | 23.45,24.8 U2.75 22.45,26 v22.45,26.45
  Bottom 0.152: v6.34,37.41 6.87,37.41 10.37,33.91 15.67,33.91 20.58,29 21.11,29 22.7,27.4 22.7,26.71 v22.45,26.45

### Text on the board
tPlace: - +
tNames: 2 | I/O GND 3.3v | I/O ADC GND 3.3v | 1 | RX / / TX
bNames: 5v GND 5v